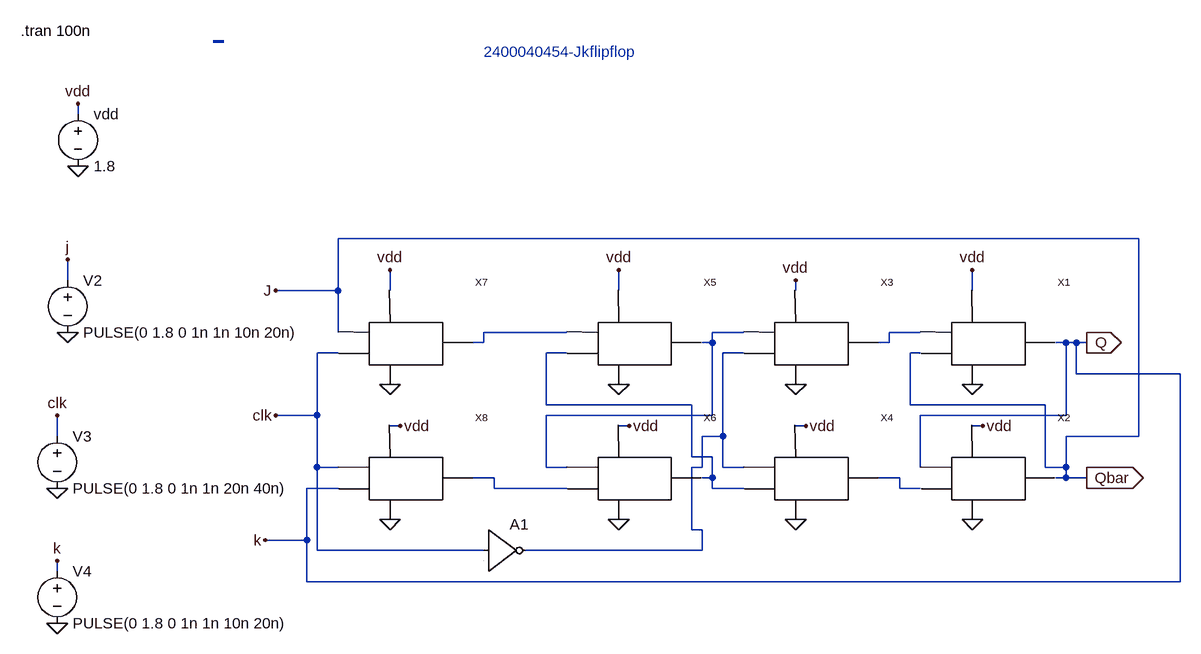
[diagram p0: schematic jk.asc]
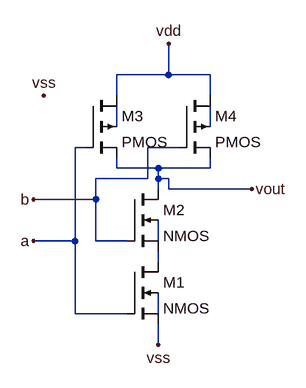
[diagram p1: sub-circuit nand.asc]
jk.asc, the LTspice schematic file:
Version 4.1
SHEET 1 880 680
WIRE -976 -256 -976 -272
WIRE 656 -64 -576 -64
WIRE -992 0 -992 -32
WIRE -576 16 -576 -64
WIRE -576 16 -672 16
WIRE -496 16 -496 -16
WIRE -144 16 -144 -16
WIRE 128 16 128 0
WIRE 400 16 400 -16
WIRE -576 80 -576 16
WIRE -224 80 -352 80
WIRE 48 80 0 80
WIRE 320 80 272 80
WIRE -352 96 -352 80
WIRE -352 96 -368 96
WIRE 0 96 0 80
WIRE 0 96 -16 96
WIRE 272 96 272 80
WIRE 272 96 256 96
WIRE 544 96 528 96
WIRE 560 96 544 96
WIRE 576 96 560 96
WIRE -576 112 -608 112
WIRE -224 112 -256 112
WIRE 48 112 16 112
WIRE 320 112 304 112
WIRE 560 144 560 96
WIRE 720 144 560 144
WIRE -256 192 -256 112
WIRE -32 192 -256 192
WIRE 304 192 304 112
WIRE 512 192 304 192
WIRE -608 208 -608 112
WIRE -608 208 -672 208
WIRE 0 208 0 96
WIRE 0 208 -256 208
WIRE 544 208 544 96
WIRE 544 208 320 208
WIRE -480 224 -496 224
WIRE -128 224 -144 224
WIRE 144 224 128 224
WIRE 416 224 400 224
WIRE -1008 240 -1008 208
WIRE 16 240 16 112
WIRE 16 240 -16 240
WIRE 656 240 656 -64
WIRE 656 240 544 240
WIRE -32 272 -32 192
WIRE 0 272 -32 272
WIRE -608 288 -608 208
WIRE -576 288 -608 288
WIRE -256 288 -256 208
WIRE -224 288 -256 288
WIRE -16 288 -16 240
WIRE -16 288 -32 288
WIRE 16 288 16 240
WIRE 48 288 16 288
WIRE 320 288 320 208
WIRE 512 288 512 192
WIRE 544 288 544 240
WIRE 544 288 512 288
WIRE -336 304 -368 304
WIRE 0 304 0 272
WIRE 0 304 -16 304
WIRE 288 304 256 304
WIRE 544 304 544 288
WIRE 544 304 528 304
WIRE 576 304 544 304
WIRE -576 320 -624 320
WIRE -336 320 -336 304
WIRE -224 320 -336 320
WIRE 0 320 0 304
WIRE 48 320 0 320
WIRE 288 320 288 304
WIRE 320 320 288 320
WIRE -32 384 -32 288
WIRE -16 384 -32 384
WIRE -624 400 -624 320
WIRE -624 400 -688 400
WIRE -608 416 -608 288
WIRE -352 416 -608 416
WIRE -16 416 -16 384
WIRE -16 416 -288 416
WIRE -1008 448 -1008 432
WIRE -624 464 -624 400
WIRE 720 464 720 144
WIRE 720 464 -624 464
FLAG 576 96 Q
IOPIN 576 96 Out
FLAG 576 304 Qbar
IOPIN 576 304 Out
FLAG -672 16 J
FLAG -672 208 clk
FLAG -688 400 k
FLAG -496 -16 vdd
FLAG -144 -16 vdd
FLAG 128 0 vdd
FLAG 400 -16 vdd
FLAG 416 224 vdd
FLAG 144 224 vdd
FLAG -128 224 vdd
FLAG -480 224 vdd
FLAG -496 160 0
FLAG -496 368 0
FLAG -144 160 0
FLAG -144 368 0
FLAG 128 368 0
FLAG 128 160 0
FLAG 400 160 0
FLAG 400 368 0
FLAG -976 -272 vdd
FLAG -992 -32 j
FLAG -1008 208 clk
FLAG -1008 432 k
FLAG -976 -176 0
FLAG -992 80 0
FLAG -1008 320 0
FLAG -1008 528 0
BUSTAP -768 -368 -752 -368
SYMBOL nand 416 96 R0
SYMATTR InstName X1
SYMBOL nand 416 304 R0
SYMATTR InstName X2
SYMBOL nand 144 96 R0
SYMATTR InstName X3
SYMBOL nand 144 304 R0
SYMATTR InstName X4
SYMBOL nand -128 96 R0
SYMATTR InstName X5
SYMBOL nand -128 304 R0
SYMATTR InstName X6
SYMBOL nand -480 96 R0
SYMATTR InstName X7
SYMBOL nand -480 304 R0
SYMATTR InstName X8
SYMBOL Digital\\inv -352 352 R0
SYMATTR InstName A1
SYMBOL voltage -976 -272 R0
SYMATTR InstName vdd
SYMATTR Value 1.8
SYMBOL voltage -992 -16 R0
WINDOW 123 0 0 Left 0
WINDOW 39 0 0 Left 0
SYMATTR InstName V2
SYMATTR Value PULSE(0 1.8 0 1n 1n 10n 20n)
SYMBOL voltage -1008 224 R0
WINDOW 123 0 0 Left 0
WINDOW 39 0 0 Left 0
SYMATTR InstName V3
SYMATTR Value PULSE(0 1.8 0 1n 1n 20n 40n)
SYMBOL voltage -1008 432 R0
WINDOW 123 0 0 Left 0
WINDOW 39 0 0 Left 0
SYMATTR InstName V4
SYMATTR Value PULSE(0 1.8 0 1n 1n 10n 20n)
TEXT -1064 -384 Left 2 !.tran 100n
TEXT -352 -352 Left 2 ;2400040454-Jkflipflop

nand.asc, the sub-circuit schematic file:
Version 4.1
SHEET 1 880 680
WIRE 192 -32 192 -80
WIRE 192 -32 112 -32
WIRE 256 -32 192 -32
WIRE 112 0 112 -32
WIRE 256 0 256 -32
WIRE 112 48 112 16
WIRE 256 48 256 16
WIRE 64 80 48 80
WIRE 208 80 160 80
WIRE 112 112 112 96
WIRE 176 112 112 112
WIRE 256 112 256 96
WIRE 256 112 176 112
WIRE 160 128 160 80
WIRE 160 128 80 128
WIRE 176 128 176 112
WIRE 192 128 176 128
WIRE 176 144 176 128
WIRE 192 144 192 128
WIRE 320 144 192 144
WIRE 80 160 80 128
WIRE 80 160 -16 160
WIRE 48 224 48 80
WIRE 48 224 -16 224
WIRE 80 224 80 160
WIRE 128 224 80 224
WIRE 176 224 176 192
WIRE 176 256 176 240
WIRE 48 336 48 224
WIRE 128 336 48 336
WIRE 176 336 176 304
WIRE 176 384 176 352
FLAG -16 224 a
FLAG -16 160 b
FLAG 192 -80 vdd
FLAG 320 144 vout
FLAG 176 384 vss
FLAG 0 0 vss
SYMBOL nmos4 128 256 R0
SYMATTR InstName M1
SYMBOL nmos4 128 144 R0
SYMATTR InstName M2
SYMBOL pmos4 64 0 R0
SYMATTR InstName M3
SYMBOL pmos4 208 0 R0
SYMATTR InstName M4

The netlist it stands for:
* jk.asc
X§X1 N003 J vdd 0 k nand
X§X2 k N007 vdd 0 J nand
X§X3 N002 N005 vdd 0 N003 nand
X§X4 N005 N004 vdd 0 N007 nand
X§X5 N001 N004 vdd 0 N002 nand
X§X6 N002 N006 vdd 0 N004 nand
X§X7 J clk vdd 0 N001 nand
X§X8 clk k vdd 0 N006 nand
A1 clk 0 0 0 0 N005 0 0 BUF
vdd vdd 0 1.8
V2 J 0 PULSE(0 1.8 0 1n 1n 10n 20n)
V3 clk 0 PULSE(0 1.8 0 1n 1n 20n 40n)
V4 k 0 PULSE(0 1.8 0 1n 1n 10n 20n)

* block symbol definitions
.subckt nand a b vdd vss vout
M1 N004 a vss N005 NMOS
M2 vout b N004 N003 NMOS
M3 vdd a vout N001 PMOS
M4 vdd b vout N002 PMOS
.ends nand

.model NMOS NMOS
.model PMOS PMOS
.lib standard.mos
.tran 100n
* 2400040454-Jkflipflop
.backanno
.end